# EAGLE design room_auto_lock_V1.0 (EAGLE 8.6.0)
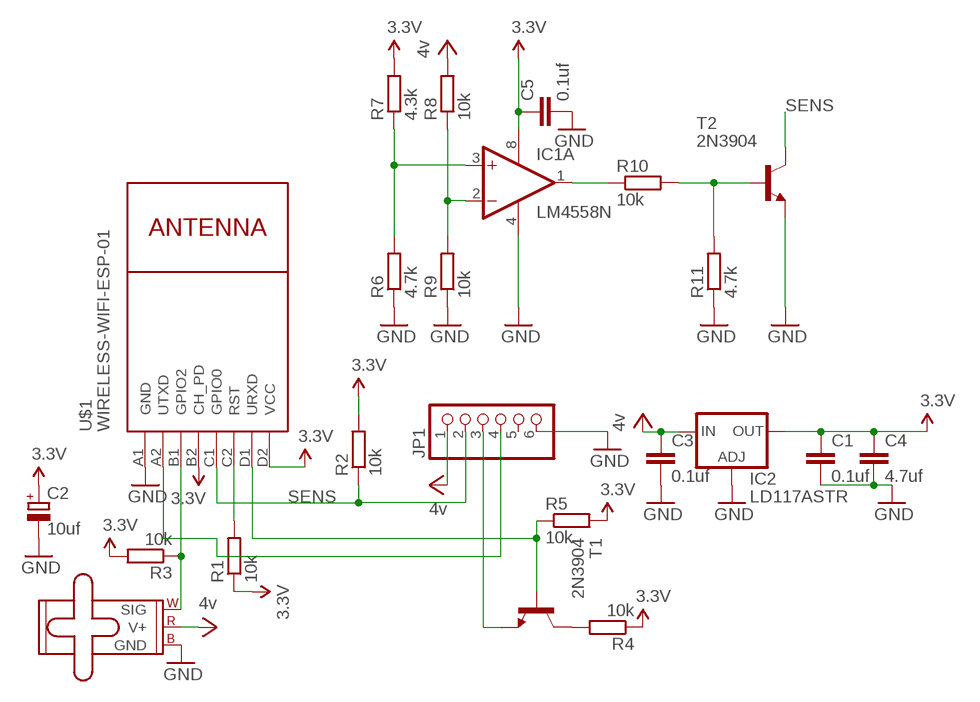
[diagram p0: schematic, sheet 1]

## Parts
C1  0.1uf  C-EUC0805  [C0805]
C2  10uf  CPOL-EUE2.5-6  [E2,5-6]
C3  0.1uf  C-EUC0805  [C0805]
C4  4.7uf  C-EUC1206K  [C1206K]
C5  0.1uf  C-EUC0805  [C0805]
IC1  LM4558N  [DIL08]
IC2  LD117ASTR  [SOT223]
JP1  PINHD-1X6  [1X06]
M1  SMALL_SERVO  [1X03]
R1  10k  R-EU_M2012  [M2012]
R2  10k  R-EU_M2012  [M2012]
R3  10k  R-EU_M2012  [M2012]
R4  10k  R-EU_M2012  [M2012]
R5  10k  R-EU_M2012  [M2012]
R6  4.7k  R-EU_0207/2V  [0207/2V]
R7  4.3k  R-EU_0207/2V  [0207/2V]
R8  10k  R-EU_R1206  [R1206]
R9  10k  R-EU_R1206  [R1206]
R10  10k  R-EU_R1206  [R1206]
R11  4.7k  R-EU_0207/10  [0207/10]
T1  2N3904  [TO92]
T2  2N3904  [TO92]
U$1  WIRELESS-WIFI-ESP-01  [WIRELESS-WIFI-ESP-01]

## Nets
3.3V: C1.1 C2.+ C4.1 C5.1 IC1.8(P:V+) IC2.4(OUT) R1.1 R2.2 R3.2 R4.1 R5.2 R7.2 U$1.B2(CH_PD) U$1.D2(VCC)
GND: C1.2 C2.- C3.2 C4.2 C5.2 IC1.4(P:V-) IC2.1(ADJ) JP1.6 M1.3(GND) R6.1 R9.1 R11.1 T2.3(E) U$1.A1(GND)
N$1: M1.1(SIG) R3.1 U$1.B1(GPIO2)
N$2: R1.2 U$1.C2(RST)
N$5: R5.1 T1.2(B) U$1.D1(URXD)
N$6: JP1.4 U$1.A2(UTXD)
N$9: R4.2 T1.1(C)
N$10: JP1.3 T1.3(E)
N$12: IC1.2(A:-IN) R8.1 R9.2
N$13: IC1.3(A:+IN) R6.2 R7.1
N$14: IC1.1(A:OUT) R10.1
N$15: R10.2 R11.2 T2.2(B)
SENS: JP1.2 R2.1 T2.1(C) U$1.C1(GPIO0)
VCC: C3.1 IC2.3(IN) JP1.1 M1.2(V+) R8.2 ; supply symbol labelled 4v
Unconnected: IC1.5(B:+IN) IC1.6(B:-IN) IC1.7(B:OUT) JP1.5

## Library data of the parts
C1 C3-C5 = resistor:C-EU: CAPACITOR, European symbol
C2 = resistor:CPOL-EU: POLARIZED CAPACITOR, European symbol
IC1 = linear:*4558: OP AMP
IC2 = v-reg:LD117A?*: Low drop fixed and adjustable positive voltage regulators 1 A Source: http://www.st.com/stonline/products/literature/ds/7194/ld1117axx.pdf
JP1 = pinhead:PINHD-1X6: PIN HEADER
M1 = SparkFun-Electromechanical:SMALL_SERVO: Small servo motor This is the small servo used in the SIK. SKU: ROB-09065
R1-R11 = resistor:R-EU_: RESISTOR, European symbol
T1 T2 = transistor:2N3904: NPN TRANSISTOR
U$1 = diy-modules:WIRELESS-WIFI-ESP-01: Wireless Wi-Fi ESP-01 Module based on ESP8266 chip

## Board
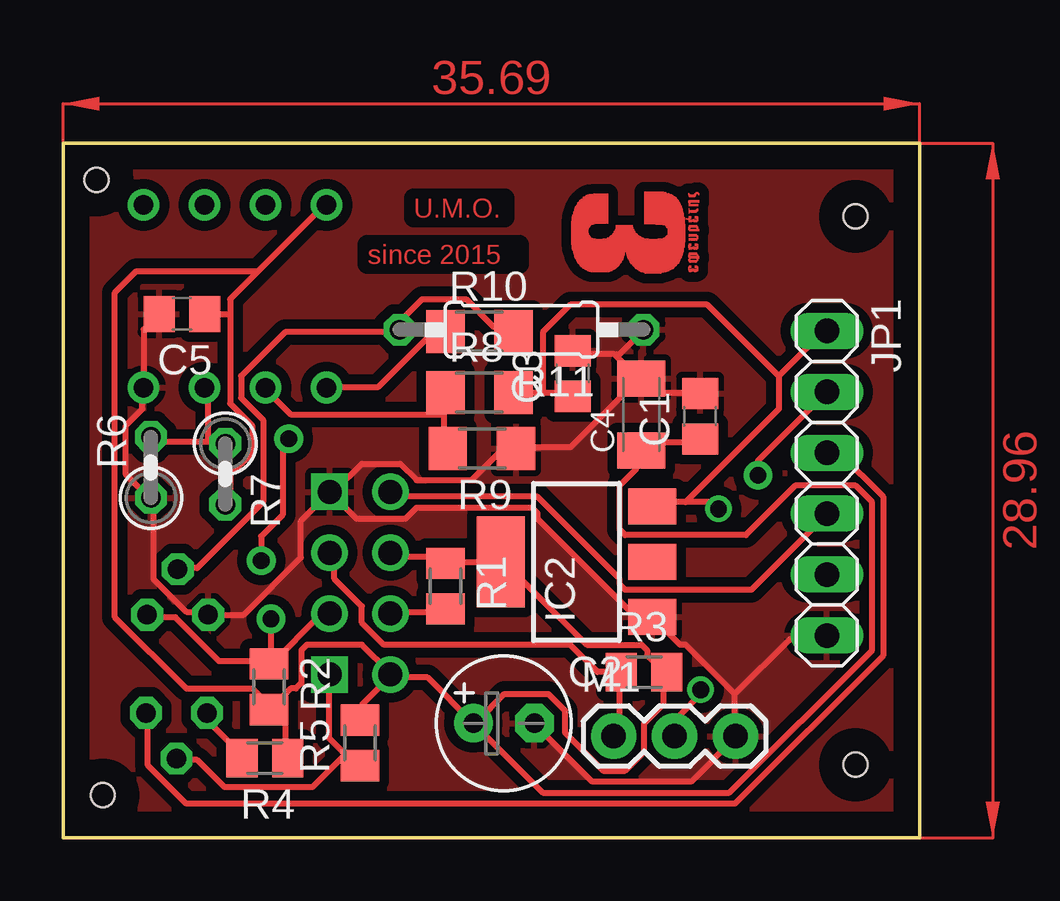
[diagram p1: board, top side]
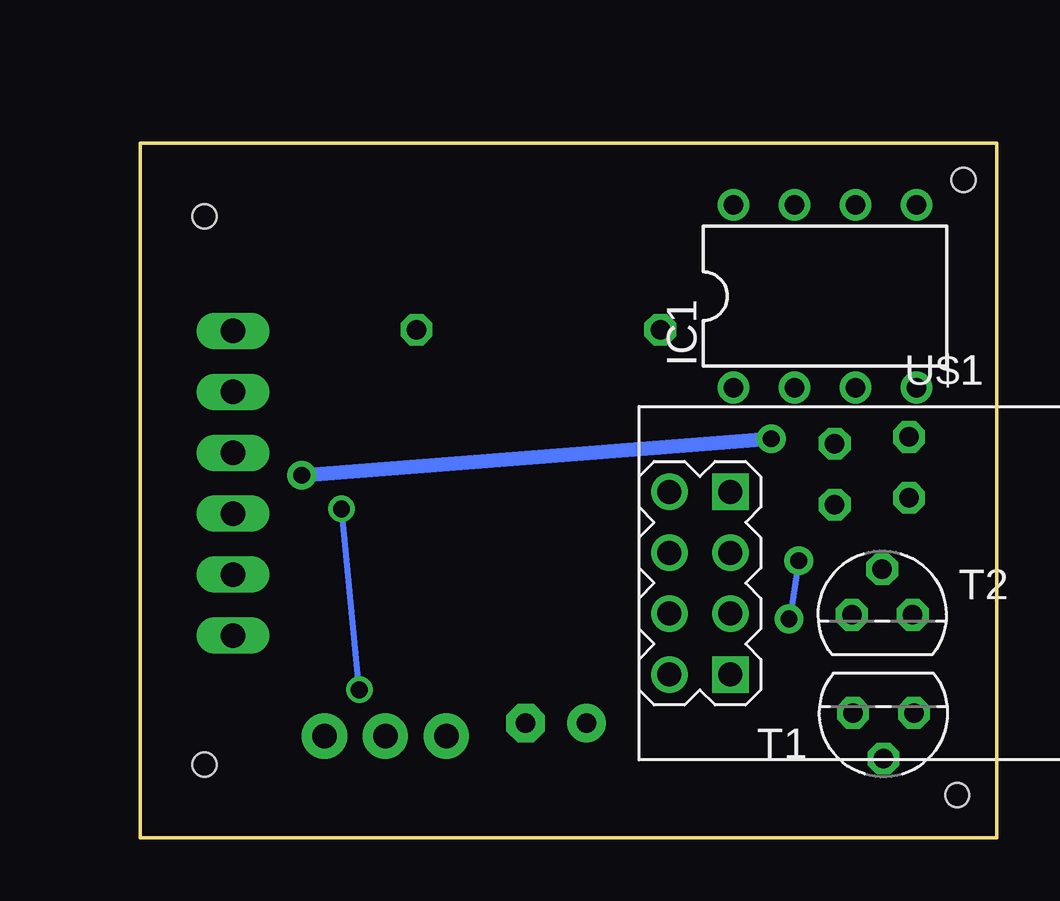
[diagram p2: board, bottom side, seen from below]

Size 35.69 x 28.96 mm. Coordinates in mm from the lower left corner, seen from the top.
Outline: 0,28.96 35.69,28.96 35.69,0 0,0 0,28.96
Copper layers (1*16): Top 0.035mm / dielectric 1.5mm / Bottom 0.035mm
Design rules "default": minimum track width 10mil, minimum drill 24mil, track to track 8mil, track to pad 8mil, pad to pad 8mil, via to via 8mil, smd to smd 8mil, copper to edge 40mil, drill to drill 8mil, minimum pad ring 10mil, minimum via ring 8mil, stop-mask expansion 4mil, vias tented up to drill 0mil, thermal gap 10mil
Holes 1 mm at 33.02,25.91 33.02,3.05 1.4,27.43 1.65,1.78

### Footprints (pad centres in the part's own frame; a part is rotated, then mirrored left to right if it is on the bottom)
C0805 = smd 1.3 x 1.5: 1 -0.95,0; 2 0.95,0
E2,5-6 = drill 0.813 pad 1.6: + -1.27,0 | drill 0.813 pad 1.6 octagon: - 1.27,0
C1206K = smd 1.5 x 2: 1 -1.5,0; 2 1.5,0
DIL08 = drill 0.813 pad 1.27: 1 -3.81,-3.81; 2 -1.27,-3.81; 3 1.27,-3.81; 4 3.81,-3.81; 5 3.81,3.81; 6 1.27,3.81; 7 -1.27,3.81; 8 -3.81,3.81
SOT223 = smd 1.5 x 2: 1 -2.3,-3.15; 2 0,-3.15; 3 2.3,-3.15 | smd 3.8 x 2: 4 0,3.15
1X06 = drill 1.016 long: 1 -6.35,0; 2 -3.81,0; 3 -1.27,0; 4 1.27,0; 5 3.81,0; 6 6.35,0
1X03 = drill 1.016 pad 1.88: 1 0,0; 2 2.54,0; 3 5.08,0
M2012 = smd 1.3 x 1.6: 1 -0.95,0; 2 0.95,0
0207/2V = drill 0.813 octagon: 1 -1.27,0; 2 1.27,0
R1206 = smd 1.6 x 1.803: 1 -1.422,0; 2 1.422,0
0207/10 = drill 0.813 octagon: 1 -5.08,0; 2 5.08,0
TO92 = drill 0.813 octagon: 1 1.27,0; 2 0,1.905; 3 -1.27,0
WIRELESS-WIFI-ESP-01 = drill 1 square: A1 -8.89,3.81; D1 -8.89,-3.81 | drill 1: A2 -11.43,3.81; B1 -8.89,1.27; B2 -11.43,1.27; C1 -8.89,-1.27; C2 -11.43,-1.27; D2 -11.43,-3.81

### Placement (x,y rotation side)
C1  26.54,17.58 90 top
C2  18.36,4.78 0 top
C3  21.23,19.35 90 top
C4  24.08,17.65 90 top
C5  4.95,21.84 180 top
IC1  7.16,22.58 0 bottom
IC2  21.39,11.51 90 top
JP1  31.83,14.78 270 top
M1  22.94,4.24 0 top
R1  15.93,10.49 270 top
R2  8.59,6.3 270 top
R3  24.21,6.91 0 top
R4  8.41,3.33 180 top
R5  12.37,3.96 90 top
R6  3.66,15.44 90 top
R7  6.76,15.16 270 top
R8  17.35,18.57 0 top
R9  17.45,16.23 180 top
R10  17.35,21.11 0 top
R11  19.1,21.18 180 top
T1  4.72,5.21 180 bottom
T2  4.78,9.3 0 bottom
U$1  2.21,10.62 0 bottom

### Tracks (layer width: path | path; a pad name or v marks a point on that pad's centre or on a via)
3.3V
  Top 0.254: 25.25,6.91 R3.2 25.02,6.91 | U$1.B2 13.82,11.71 15.65,11.71 15.88,11.48 R1.1 16.1,11.48 18.16,11.48 IC2.4 18.39,11.48 21.82,8.05 24.11,8.05 24.33,7.82 24.33,7.59 25.02,6.91 | 6.96,21.84 6.96,22.45 8.13,23.62 | 6.96,21.84 6.96,18.11 7.87,17.2 7.87,16.05 6.96,15.14 6.96,14 R7.2 | 8.13,23.62 10.85,26.34 IC1.8 | R4.1 9.25,3.48 9.25,4.85 8.79,5.31 R2.2 | R5.2 12.45,5.08 12.45,5.54 13.59,6.68 U$1.D2 | R2.2 8.79,5.54 9.47,6.22 9.7,6.22 9.93,6.45 9.93,7.82 10.16,8.05 12.45,8.05 13.59,6.91 U$1.D2 | C1.1 26.39,16.51 24.33,16.51 24.11,16.28 C4.1 23.88,16.05 23.88,15.37 23.19,14.68 23.19,12.85 23.42,12.62 28.45,12.62 30.5,14.68 33.02,14.68 33.71,14 33.71,7.82 27.76,1.88 19.99,1.88 C2.+ | C2.+ 15.19,6.68 13.82,6.68 U$1.D2 | R2.2 8.56,5.54 7.87,6.22 5.13,6.22 2.16,9.2 2.16,22.73 3.05,23.62 8.13,23.62 | C2.+ 17.25,4.85 18.39,5.99 20.22,5.99 20.9,5.31 20.9,4.39 22.5,2.79 23.42,2.79 24.21,3.58 24.21,4.77 25.02,5.58 25.02,6.91 | C5.1 6.96,21.84
GND
  Top 0.254: 27.99,5.99 25.93,8.05 25.71,8.05 24.56,9.2 IC2.1 24.33,9.42 23.65,9.42 19.76,13.31 19.76,13.54 19.53,13.77 14.73,13.77 14.28,13.31 12.22,13.31 U$1.A1 | 27.99,5.99 27.99,4.39 M1.3 27.99,4.17 26.16,2.34 22.05,2.34 19.76,4.62 C2.- | 27.99,5.99 30.28,8.28 31.65,8.28 JP1.6 | C1.2 26.39,18.57 24.56,18.57 24.11,19.02 C4.2 | 22.96,20.17 21.36,20.17 C3.2 | 22.96,20.17 23.88,19.25 C4.2 | C4.2 23.88,19.02 21.13,16.28 19.07,16.28 R9.1 18.85,16.05 18.16,16.05 17.02,14.91 14.73,14.91 14.05,15.6 12.45,15.6 11.3,14.45 U$1.A1 | 22.96,20.17 23.19,20.17 24.11,21.08 R11.1 | T2.3 6.05,9.42 5.13,9.42 3.76,10.8 3.76,14 R6.1 3.53,14.22 2.62,15.14 2.62,17.2 3.3,17.88 3.3,18.57 IC1.4 3.35,21.19 C5.2 | 11.07,14.22 U$1.A1 | 6.05,9.2 T2.3 | T2.3 7.52,9.3 9.91,11.68 9.91,13.21 11.1,14.4 U$1.A1
  pour Top (isolate 0.406): 0.51,28.45 35.18,28.45 35.18,0.51 0.51,0.51
N$1
  Top 0.254: 23.19,6.91 23.19,4.62 22.96,4.39 M1.1 | 23.19,6.91 22.28,6.91 21.13,8.05 13.36,8.05 12.45,8.97 12.45,9.65 11.3,10.8 11.3,11.71 U$1.B1 | 23.19,6.91 R3.1
N$2
  Top 0.254: R1.2 15.88,9.42 13.82,9.42 U$1.C2
N$3
  pour Top (isolate 0.406): 0.51,28.45 35.31,28.45 35.31,0.25 0.51,0.25
N$5
  Top 0.254: 11.76,3.48 11.07,4.17 11.07,6.68 U$1.D1 | 11.76,3.48 12.22,3.02 R5.1 11.76,3.48 | 11.76,3.48 10.39,2.11 6.73,2.11 5.59,3.25 4.9,3.25 T1.2
N$6
  Top 0.254: U$1.A2 13.82,14.22 19.76,14.22 23.19,10.8 23.19,10.57 23.42,10.34 28.68,10.34 31.65,13.31 JP1.4
N$9
  Top 0.254: R4.2 7.42,3.48 5.82,5.08 T1.1
N$10
  Top 0.254: JP1.3 32.33,16.05 34.16,14.22 34.16,7.59 27.99,1.42 5.13,1.42 3.53,3.02 3.53,5.08 T1.3
N$12
  Top 0.254: 15.88,17.65 15.88,16.28 R9.2 | 15.88,17.65 15.88,18.57 R8.1 | 15.88,17.65 9.47,17.65 8.56,18.57 IC1.2
N$13
  Top 0.254: 6.05,16.51 6.73,16.51 R7.1 | 6.05,16.51 3.76,16.51 R6.2 | 6.05,16.51 6.05,18.57 IC1.3
N$14
  Top 0.254: R10.1 15.88,21.08 15.42,21.08 13.13,18.8 11.07,18.8 IC1.1
N$15
  Top 0.254: R10.2 18.62,21.31 17.93,21.31 16.79,22.45 14.96,22.45 13.82,21.31 R11.2 13.82,21.08 9.25,21.08 7.42,19.25 7.42,18.34 8.33,17.42 8.33,14 5.59,11.25 4.9,11.25 T2.2
SENS  (via drill 0.7 pad 1.2)
  Top 0.254: 8.79,7.37 10.62,9.2 11.07,9.2 U$1.C1 | 8.79,7.37 R2.1 8.56,7.37 6.5,7.37 4.67,9.2 3.53,9.2 T2.1 | JP1.2 28.96,15.72 v28.96,15.11 28.96,14.99 | v9.4,16.64 9.14,16.38 9.14,13.46 8.25,12.57 v8.25,11.56 | v8.66,9.12 8.66,7.5 8.79,7.37
  Bottom 0.254: v8.25,11.56 8.64,9.14 v8.66,9.12
  Bottom 0.61: v28.96,15.11 9.53,16.64 v9.4,16.64
VCC  (via drill 0.7)
  Top 0.254: R8.2 19.99,18.57 | 19.99,18.57 21.13,18.57 C3.1 | 25.93,14 24.56,14 IC2.3 | 25.93,14 29.82,17.88 29.82,19.25 | 29.82,19.25 31.65,21.08 JP1.1 | 19.99,18.57 19.99,21.08 21.13,22.22 26.85,22.22 29.82,19.25 | M1.2 25.48,4.9 26.8,6.22 26.61,6.22 v26.56,6.17 | v27.31,13.72 27.03,14 25.93,14
  Bottom 0.254: v26.56,6.17 v27.31,13.72
(copper drawn outside any net)
  shapes: Top area x501

### Text on the board
Top: U.M.O. | since 2015